# Altium schematic sheet uC.SchDoc: Binary to DEC/HEX/BCD/U2/U1
size A4; DrawnBy: Jakub Kajzer; Revision: 1.0; SheetNumber: 1; SheetTotal: 3
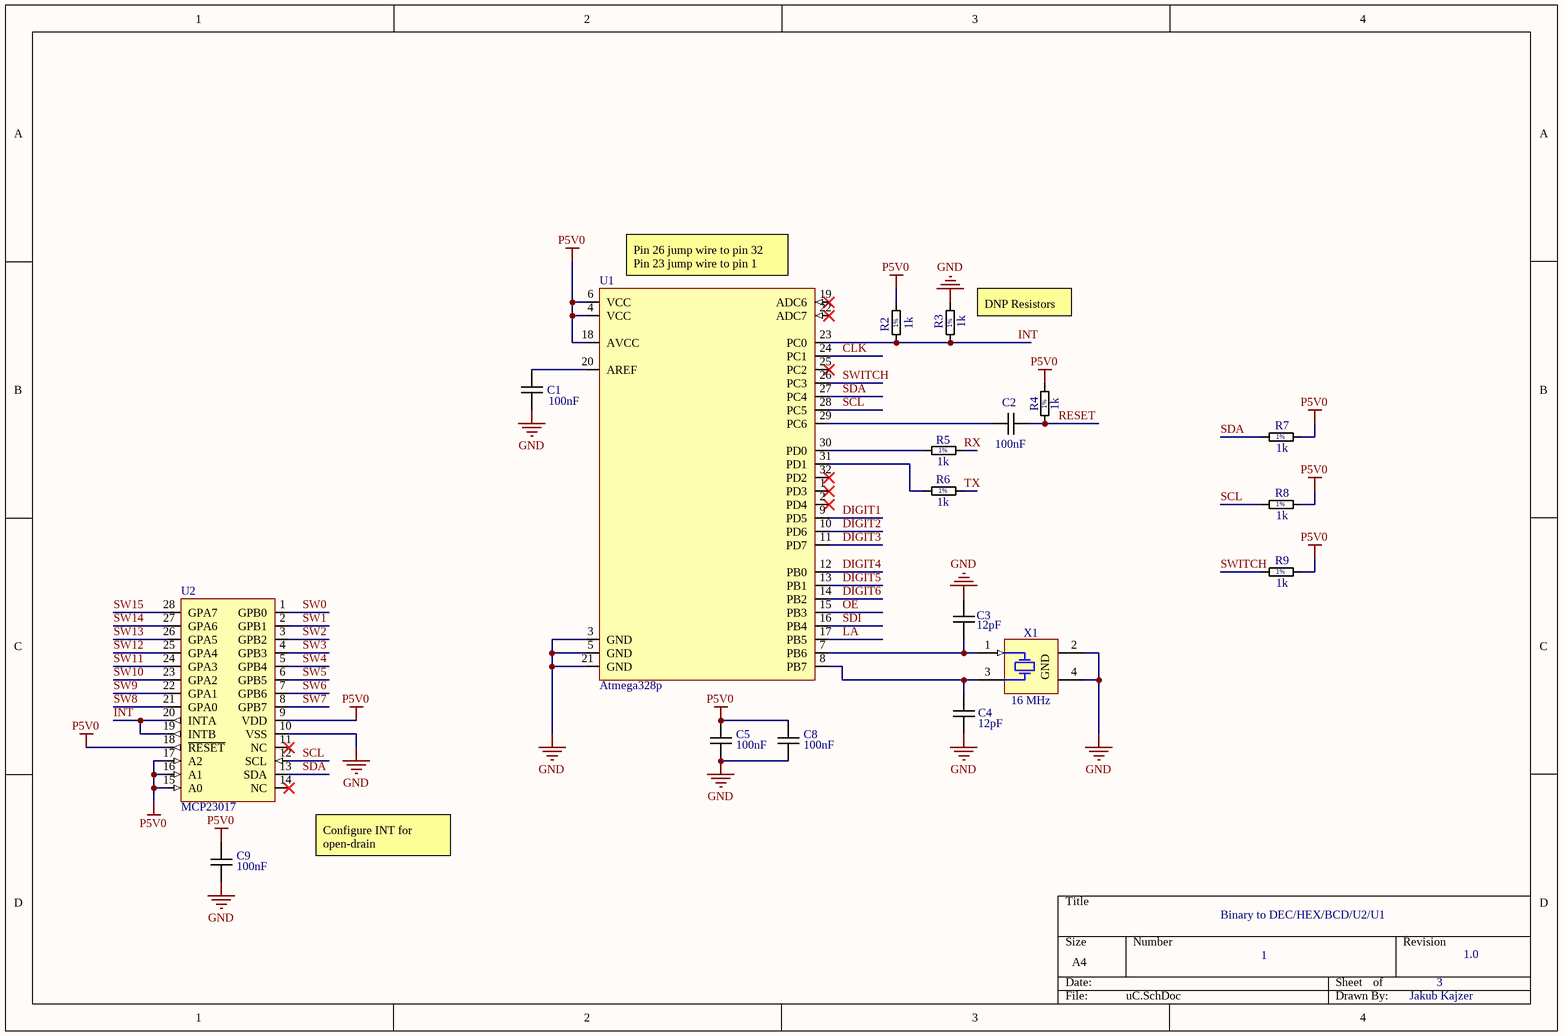
[diagram p0: uC.SchDoc]

## Parts
C1  100nF  [CAPC0402X60N]
C2  100nF  [CAPC0402X60N]
C3  12pF  [CAPC0402X60N]
C4  12pF  [CAPC0402X60N]
C5  100nF  [CAPC0402X60N]
C8  100nF  [CAPC0402X60N]
C9  100nF  [CAPC0402X60N]
R2  1k  [RESC0402X40N]
R3  1k  [RESC0402X40N]
R4  1k  [RESC0402X40N]
R5  1k  [RESC0402X40N]
R6  1k  [RESC0402X40N]
R7  1k  [RESC0402X40N]
R8  1k  [RESC0402X40N]
R9  1k  [RESC0402X40N]
U1  Atmega328p  [STM-LQFP32_N]
U2  MCP23017  [SSOP28]
X1  16 MHz  [LFXTAL069392CUTT]

## Nets
GND: C1.1 C3.2 C4.1 C5.1 C8.1 C9.1 R3.2 U1.3(GND) U1.5(GND) U1.21(GND) U2.10(VSS) X1.2(GND) X1.4(GND)
P5V0: C5.2 C8.2 C9.2 R2.2 R4.2 R7.2 R8.2 R9.2 U1.4(VCC) U1.6(VCC) U1.18(AVCC) U2.9(VDD) U2.15(A0) U2.16(A1) U2.17(A2) U2.18(~{RESET})
CLK: U1.24(PC1)
DIGIT1: U1.9(PD5)
DIGIT2: U1.10(PD6)
DIGIT3: U1.11(PD7)
DIGIT4: U1.12(PB0)
DIGIT5: U1.13(PB1)
DIGIT6: U1.14(PB2)
INT: R2.1 R3.1 U1.23(PC0) U2.19(INTB) U2.20(INTA)
LA: U1.17(PB5)
OE: U1.15(PB3)
RESET: C2.2 R4.1
RX: R5.2
SCL: R8.1 U1.28(PC5) U2.12(SCL)
SDA: R7.1 U1.27(PC4) U2.13(SDA)
SDI: U1.16(PB4)
SW0: U2.1(GPB0)
SW1: U2.2(GPB1)
SW2: U2.3(GPB2)
SW3: U2.4(GPB3)
SW4: U2.5(GPB4)
SW5: U2.6(GPB5)
SW6: U2.7(GPB6)
SW7: U2.8(GPB7)
SW8: U2.21(GPA0)
SW9: U2.22(GPA1)
SW10: U2.23(GPA2)
SW11: U2.24(GPA3)
SW12: U2.25(GPA4)
SW13: U2.26(GPA5)
SW14: U2.27(GPA6)
SW15: U2.28(GPA7)
SWITCH: R9.1 U1.26(PC3)
TX: R6.2
NetC1_2: C1.2 U1.20(AREF)
NetC2_1: C2.1 U1.29(PC6)
NetC3_1: C3.1 U1.7(PB6) X1.1(X)
NetC4_2: C4.2 U1.8(PB7) X1.3(X)
NetR5_1: R5.1 U1.30(PD0)
NetR6_1: R6.1 U1.31(PD1)

Not connected (* = marked no-connect by the designer): U1 1(PD3)* 2(PD4)* 19(ADC6)* 22(ADC7)* 25(PC2)* 32(PD2)*; U2 11(NC)* 14(NC)*

## Notes on the sheet
- (near U1) Pin 26 jump wire to pin 32
  Pin 23 jump wire to pin 1
- (near R3) DNP Resistors
- (near U2) Configure INT for open-drain

## Library data of the parts
C1 C2 C5 C8 C9 = CC0402_100NF_16V_10%_X7R: Non-polarised capacitor; Manufacturer: GENERIC; Manufacturer 1 Example: Samsung; Manufacturer 1 Part Number: CL05B104KO5NNNC; Manufacturer 1 Component Height: 0.5mm; PressFit: No; Dielectric: X7R; Tolerance: 10%; Voltage: 16V; DesignItemId: CC0402_100NF_16V_10%_X7R; Author: KB; Case: 0402 (1005 metric); Component Kind: Standard; HelpURL: http://www.farnell.com/datasheets/1870456.pdf?_ga=2.66904750.1666480506.1564307475-778048469.1556931874&_gac=1.242951606.1563147047.EAIaIQobChMIrfuAvMi14wIVB-J3Ch1XegfpEAYYASABEgIMVfD_BwE; Manufacturer Part Number: CC0402_100NF_16V_10%_X7R; Mounted: Yes; Part Description: Non-polarised capacitor; Pin Count: 2; Sense: No; SMD: Yes; Socket: No; Status: Recommended; Value: 100nF; Supplier 1: TME; Supplier 2: Farnell; Supplier 3: Mouser; Create Date: 29.07.2019; LatestRevisionDate: 29.07.2019; Supplier Part Number 1: CL05B104KO5NNNC; Supplier Part Number 2: 1758896; Supplier Part Number 3: 710-885012205037
C3 C4 = CC0402_12PF_50V_5%_C0G: Non-polarised capacitor; Manufacturer: GENERIC; Manufacturer 1 Example: Murata; Manufacturer 1 Part Number: GRM1555C1H120JA01D; Manufacturer 1 Component Height: 0.5mm; PressFit: No; Dielectric: C0G; Tolerance: 5%; Voltage: 50V; DesignItemId: CC0402_12PF_50V_5%_C0G; Author: KB; Case: 0402 (1005 metric); Component Kind: Standard; HelpURL: https://search.murata.co.jp/Ceramy/image/img/A01X/G101/ENG/GJM1555C1H7R5CB01-01.pdf; Manufacturer Part Number: CC0402_12PF_50V_5%_C0G; Mounted: Yes; Part Description: Non-polarised capacitor; Pin Count: 2; Sense: No; SMD: Yes; Socket: No; Status: Recommended; Value: 12pF; Supplier 1: TME; Supplier 2: Farnell; Supplier 3: Mouser; Create Date: 28.07.2019; LatestRevisionDate: 28.07.2019; Supplier Part Number 1: GRM1555C1H120JA01D; Supplier Part Number 2: 1758943; Supplier Part Number 3: 81-GCM1555C1H120JA6J
R2-R9 = R0402_1K00_0.0625W_100PPM: General Purpose Thick Film Chip Resistor; Manufacturer: GENERIC; Manufacturer Part Number: R0402_1K00_0.0625W 0.1W 0.125W 0.25W 0.5W 1W 0.75W 1W_100PPM; Manufacturer 1 Example: Vishay; Manufacturer 1 Part Number: CRCW04021K00FKEDC; Manufacturer 1 Component Height: 0.4mm; Power: 62.5mW; Current Max: 0; PressFit: No; TC: ±100 ppm/°C; Tolerance: 1%; Voltage: 50V; DesignItemId: R0402_1K00_0.0625W_100PPM; Author: KB; Case: 0402 (1005 metric); Component Kind: Standard; Component Type: Standard; HelpURL: https://www.vishay.com/docs/20035/dcrcwe3.pdf; Mounted: Yes; Part Description: General Purpose Thick Film Chip Resistor; Pin Count: 2; Sense: No; SMD: Yes; Socket: No; Status: Recommended; Value: 1k; Supplier 1: Farnell; Supplier 2: Mouser; Supplier 3: TME; Create Date: 03.07.2019; LatestRevisionDate: 03.07.2019; Supplier Part Number 3: CRCW04021K00FKED; Supplier Part Number 2: 71-CRCW0402-1.0K-E3
U1 = Atmega328p: 8-bit AVR Microcontroller with 32K Bytes In-SystemProgrammable Flash; Manufacturer 1 Example: Atmel; Manufacturer 1 Part Number: ATMEGA328PB-AU; Manufacturer 1 Component Height: 1.2mm; PressFit: No; DesignItemId: Atmega328p; Author: JK; Device: Atmega328p; Component Kind: Standard; Footprint: LQFP-32; HelpURL: http://ww1.microchip.com/downloads/en/DeviceDoc/Atmel-7810-Automotive-Microcontrollers-ATmega328P_Datasheet.pdf; Mounted: Yes; Part Description: 8-bit AVR Microcontroller with 32K Bytes In-SystemProgrammable Flash; Pin Count: 32; Sense: No; SMD: Yes; Socket: No; Supplier 1: TME; Create Date: 21.12.2019; LatestRevisionDate: 21.12.2019; Supplier Part Number 1: ATMEGA328PB-AU
U2 = MCP23017-E/SS: 16-Bit I/O Expander with Serial Interface; Manufacturer 1 Example: Microchip; Manufacturer 1 Component Height: 1.75mm; PressFit: No; DesignItemId: MCP23017-E/SS; Author: JK; Device: MCP23017; Component Kind: Standard; HelpURL: https://www.tme.eu/Document/4a5fbc9d683fd19f7c43480a0c75c888/mcp23017.pdf; Manufacturer 1 Part Number: MCP23017-E/SS; Mounted: Yes; Part Description: 16-Bit I/O Expander with Serial Interface; Pin Count: 28; Sense: No; SMD: Yes; Socket: No; Supplier 1: Mouser; Supplier 2: Farnell; Supplier 3: TME; Create Date: 06.09.2019; LatestRevisionDate: 06.09.2019; Supplier Part Number 3: MCP23017-E/SS; Supplier Part Number 2: 1467674; Supplier Part Number 1: 579-MCP23017-E/SS
X1 = LFXTAL069392CUTT: ˇĹ0ppm 10pF -40°C to +85°C  4 Pins, 2.5x2X0.6mm; Manufacturer 1 Example: IQD FREQUENCY PRODUCTS; Manufacturer 1 Component Height: 0.6; PressFit: No; DesignItemId: LFXTAL069392CUTT; Author: PC; Value: 16 MHz; Component Kind: Standard; HelpURL: https://www.tme.eu/Document/39c21ac8c088601505d794405896ec92/LFXTAL069392Cutt.pdf; Manufacturer 1 Part Number: LFXTAL069392CUTT; Mounted: Yes; Part Description: ˇĹ0ppm 10pF -40°C to +85°C  4 Pins, 2.5x2X0.6mm; Pin Count: 4; Sense: No; SMD: Yes; Socket: No; Supplier 1: TME; Supplier 2: Mouser; Create Date: 19.08.2009; LatestRevisionDate: 19.08.2009; Supplier Part Number 2: 449-LFXTAL069392CUTT; Supplier Part Number 1: 16.00M-CFPX-218